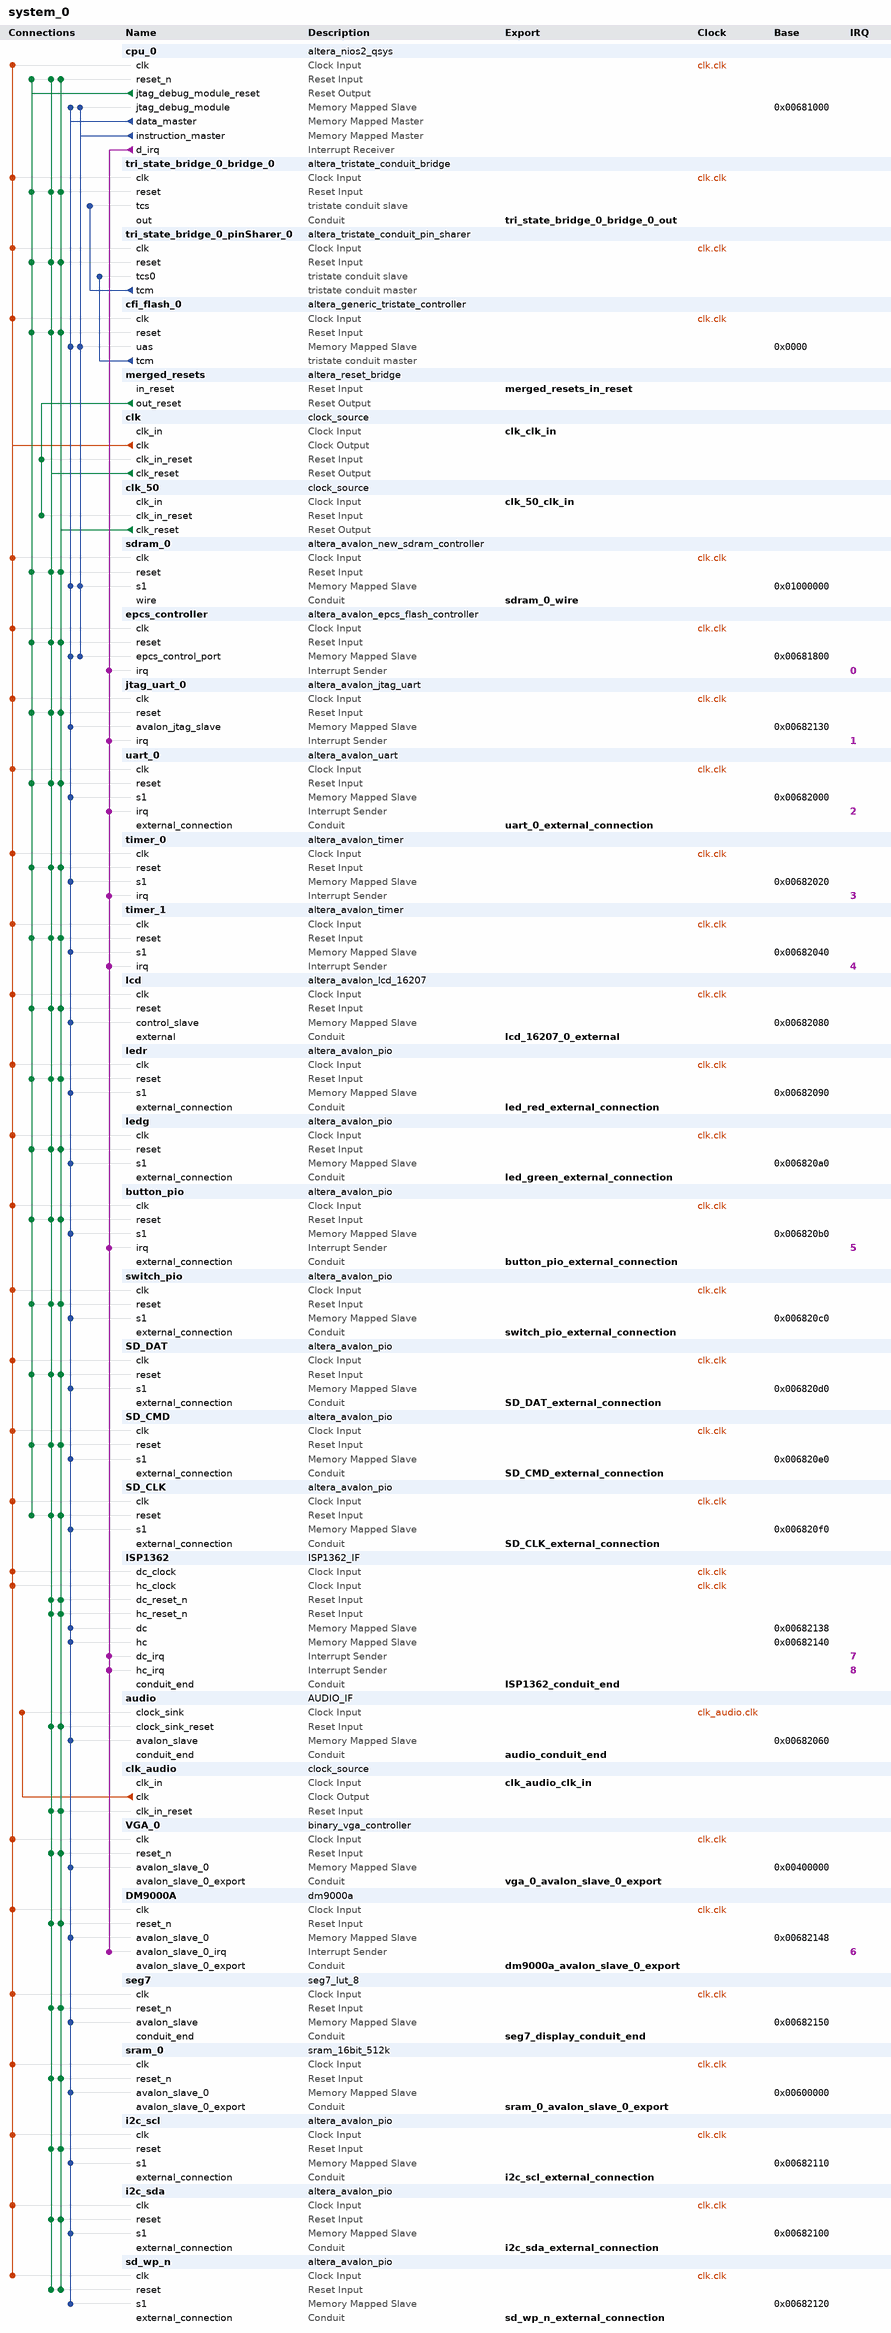
[diagram p0: system contents]
# Platform Designer (Qsys) system system_0, CYCLONEII EP2C35F672C6
# Parameters at their usual value, and those the tool derives, are not listed.
package require -exact qsys 11.1
create_system system_0
set_project_property DEVICE_FAMILY CYCLONEII
set_project_property DEVICE EP2C35F672C6

add_instance cpu_0 altera_nios2_qsys 11.1
set_instance_parameter_value cpu_0 manuallyAssignCpuID false
set_instance_parameter_value cpu_0 resetSlave sdram_0.s1
set_instance_parameter_value cpu_0 exceptionSlave sdram_0.s1
set_instance_parameter_value cpu_0 breakSlave cpu_0.jtag_debug_module
set_instance_parameter_value cpu_0 mmu_processIDNumBits 10
set_instance_parameter_value cpu_0 impl Fast
set_instance_parameter_value cpu_0 icache_size 4096
set_instance_parameter_value cpu_0 dcache_lineSize 4

add_instance tri_state_bridge_0_bridge_0 altera_tristate_conduit_bridge 11.1

add_instance tri_state_bridge_0_pinSharer_0 altera_tristate_conduit_pin_sharer 11.1
set_instance_parameter_value tri_state_bridge_0_pinSharer_0 NUM_INTERFACES 1
set_instance_parameter_value tri_state_bridge_0_pinSharer_0 MODULE_ORIGIN_LIST cfi_flash_0.tcm,cfi_flash_0.tcm,cfi_flash_0.tcm,cfi_flash_0.tcm,cfi_flash_0.tcm
set_instance_parameter_value tri_state_bridge_0_pinSharer_0 SHARED_SIGNAL_LIST tri_state_bridge_0_address,tri_state_bridge_0_readn,write_n_to_the_cfi_flash_0,tri_state_bridge_0_data,select_n_to_the_cfi_flash_0

add_instance cfi_flash_0 altera_generic_tristate_controller 11.1
set_instance_parameter_value cfi_flash_0 TCM_ADDRESS_W 22
set_instance_parameter_value cfi_flash_0 TCM_DATA_W 8
set_instance_parameter_value cfi_flash_0 TCM_BYTEENABLE_W 1
set_instance_parameter_value cfi_flash_0 TCM_READ_WAIT 160
set_instance_parameter_value cfi_flash_0 TCM_WRITE_WAIT 160
set_instance_parameter_value cfi_flash_0 TCM_SETUP_WAIT 40
set_instance_parameter_value cfi_flash_0 TCM_DATA_HOLD 40
set_instance_parameter_value cfi_flash_0 TCM_MAX_PENDING_READ_TRANSACTIONS 3
set_instance_parameter_value cfi_flash_0 TCM_TURNAROUND_TIME 2
set_instance_parameter_value cfi_flash_0 TCM_TIMING_UNITS 0
set_instance_parameter_value cfi_flash_0 TCM_READLATENCY 2
set_instance_parameter_value cfi_flash_0 TCM_SYMBOLS_PER_WORD 1
set_instance_parameter_value cfi_flash_0 USE_READ 1
set_instance_parameter_value cfi_flash_0 USE_BEGINTRANSFER 0
set_instance_parameter_value cfi_flash_0 USE_BYTEENABLE 0
set_instance_parameter_value cfi_flash_0 USE_OUTPUTENABLE 0
set_instance_parameter_value cfi_flash_0 ACTIVE_LOW_READ 1
set_instance_parameter_value cfi_flash_0 ACTIVE_LOW_BYTEENABLE 0
set_instance_parameter_value cfi_flash_0 ACTIVE_LOW_OUTPUTENABLE 0
set_instance_parameter_value cfi_flash_0 ACTIVE_LOW_BEGINTRANSFER 0
set_instance_parameter_value cfi_flash_0 CHIPSELECT_THROUGH_READLATENCY 0
set_instance_parameter_value cfi_flash_0 MODULE_ASSIGNMENT_KEYS embeddedsw.configuration.hwClassnameDriverSupportList,embeddedsw.configuration.hwClassnameDriverSupportDefault,embeddedsw.CMacro.SETUP_VALUE,embeddedsw.CMacro.WAIT_VALUE,embeddedsw.CMacro.HOLD_VALUE,embeddedsw.CMacro.TIMING_UNITS,embeddedsw.CMacro.SIZE,embeddedsw.memoryInfo.MEM_INIT_DATA_WIDTH,embeddedsw.memoryInfo.HAS_BYTE_LANE,embeddedsw.memoryInfo.IS_FLASH,embeddedsw.memoryInfo.GENERATE_DAT_SYM,embeddedsw.memoryInfo.GENERATE_FLASH,embeddedsw.memoryInfo.DAT_SYM_INSTALL_DIR,embeddedsw.memoryInfo.FLASH_INSTALL_DIR
set_instance_parameter_value cfi_flash_0 MODULE_ASSIGNMENT_VALUES {altera_avalon_lan91c111:altera_avalon_cfi_flash,altera_avalon_cfi_flash,40,160,40,"ns",4194304u,8,0,1,1,1,SIM_DIR,APP_DIR}
set_instance_parameter_value cfi_flash_0 INTERFACE_ASSIGNMENT_KEYS embeddedsw.configuration.isFlash,embeddedsw.configuration.isMemoryDevice,embeddedsw.configuration.isNonVolatileStorage
set_instance_parameter_value cfi_flash_0 INTERFACE_ASSIGNMENT_VALUES 1,1,1

add_instance merged_resets altera_reset_bridge 11.1
set_instance_parameter_value merged_resets ACTIVE_LOW_RESET 1
set_instance_parameter_value merged_resets SYNCHRONOUS_EDGES none

add_instance clk clock_source 11.1
set_instance_parameter_value clk clockFrequency 100000000

add_instance clk_50 clock_source 11.1
set_instance_parameter_value clk_50 clockFrequency 50000000

add_instance sdram_0 altera_avalon_new_sdram_controller 11.1
set_instance_parameter_value sdram_0 TAC 5.5
set_instance_parameter_value sdram_0 TRCD 20.0
set_instance_parameter_value sdram_0 TRP 20.0
set_instance_parameter_value sdram_0 casLatency 3
set_instance_parameter_value sdram_0 columnWidth 8
set_instance_parameter_value sdram_0 dataWidth 16
set_instance_parameter_value sdram_0 generateSimulationModel true
set_instance_parameter_value sdram_0 model custom
set_instance_parameter_value sdram_0 numberOfBanks 4
set_instance_parameter_value sdram_0 numberOfChipSelects 1
set_instance_parameter_value sdram_0 powerUpDelay 100.0
set_instance_parameter_value sdram_0 refreshPeriod 15.625
set_instance_parameter_value sdram_0 rowWidth 12

add_instance epcs_controller altera_avalon_epcs_flash_controller 11.1
set_instance_parameter_value epcs_controller useASMIAtom true

add_instance jtag_uart_0 altera_avalon_jtag_uart 11.1
set_instance_parameter_value jtag_uart_0 simInteractiveOptions INTERACTIVE_ASCII_OUTPUT

add_instance uart_0 altera_avalon_uart 11.1
set_instance_parameter_value uart_0 baud 115200
set_instance_parameter_value uart_0 dataBits 8
set_instance_parameter_value uart_0 fixedBaud true
set_instance_parameter_value uart_0 parity NONE
set_instance_parameter_value uart_0 stopBits 1

add_instance timer_0 altera_avalon_timer 11.1
set_instance_parameter_value timer_0 period 1
set_instance_parameter_value timer_0 periodUnits MSEC
set_instance_parameter_value timer_0 timerPreset CUSTOM

add_instance timer_1 altera_avalon_timer 11.1
set_instance_parameter_value timer_1 period 1
set_instance_parameter_value timer_1 periodUnits MSEC
set_instance_parameter_value timer_1 timerPreset CUSTOM

add_instance lcd altera_avalon_lcd_16207 11.1

add_instance ledr altera_avalon_pio 11.1
set_instance_parameter_value ledr direction Output
set_instance_parameter_value ledr width 18

add_instance ledg altera_avalon_pio 11.1
set_instance_parameter_value ledg direction Output
set_instance_parameter_value ledg width 9

add_instance button_pio altera_avalon_pio 11.1
set_instance_parameter_value button_pio captureEdge true
set_instance_parameter_value button_pio direction Input
set_instance_parameter_value button_pio edgeType FALLING
set_instance_parameter_value button_pio generateIRQ true
set_instance_parameter_value button_pio irqType EDGE
set_instance_parameter_value button_pio width 4

add_instance switch_pio altera_avalon_pio 11.1
set_instance_parameter_value switch_pio direction Input
set_instance_parameter_value switch_pio width 18

add_instance SD_DAT altera_avalon_pio 11.1
set_instance_parameter_value SD_DAT direction Bidir
set_instance_parameter_value SD_DAT width 4

add_instance SD_CMD altera_avalon_pio 11.1
set_instance_parameter_value SD_CMD direction Bidir
set_instance_parameter_value SD_CMD width 1

add_instance SD_CLK altera_avalon_pio 11.1
set_instance_parameter_value SD_CLK direction Output
set_instance_parameter_value SD_CLK width 1

add_instance ISP1362 ISP1362_IF 1.0

add_instance audio AUDIO_IF 2.0

add_instance clk_audio clock_source 11.1
set_instance_parameter_value clk_audio clockFrequency 18400000

add_instance VGA_0 binary_vga_controller 1.0.2
set_instance_parameter_value VGA_0 RAM_SIZE 307200

add_instance DM9000A dm9000a 1.0.2

add_instance seg7 seg7_lut_8 1.0.1

add_instance sram_0 sram_16bit_512k 1.0.2

add_instance i2c_scl altera_avalon_pio 11.1
set_instance_parameter_value i2c_scl direction Output
set_instance_parameter_value i2c_scl width 1

add_instance i2c_sda altera_avalon_pio 11.1
set_instance_parameter_value i2c_sda direction Bidir
set_instance_parameter_value i2c_sda width 1

add_instance sd_wp_n altera_avalon_pio 11.1
set_instance_parameter_value sd_wp_n direction Input
set_instance_parameter_value sd_wp_n width 1

# connections
add_connection clk.clk button_pio.clk clock
add_connection clk.clk cfi_flash_0.clk clock
add_connection clk.clk cpu_0.clk clock
add_connection clk.clk DM9000A.clk clock
add_connection clk.clk epcs_controller.clk clock
add_connection clk.clk i2c_scl.clk clock
add_connection clk.clk i2c_sda.clk clock
add_connection clk.clk ISP1362.dc_clock clock
add_connection clk.clk ISP1362.hc_clock clock
add_connection clk.clk jtag_uart_0.clk clock
add_connection clk.clk lcd.clk clock
add_connection clk.clk ledg.clk clock
add_connection clk.clk ledr.clk clock
add_connection clk.clk SD_CLK.clk clock
add_connection clk.clk SD_CMD.clk clock
add_connection clk.clk SD_DAT.clk clock
add_connection clk.clk sd_wp_n.clk clock
add_connection clk.clk sdram_0.clk clock
add_connection clk.clk seg7.clk clock
add_connection clk.clk sram_0.clk clock
add_connection clk.clk switch_pio.clk clock
add_connection clk.clk timer_0.clk clock
add_connection clk.clk timer_1.clk clock
add_connection clk.clk tri_state_bridge_0_bridge_0.clk clock
add_connection clk.clk tri_state_bridge_0_pinSharer_0.clk clock
add_connection clk.clk uart_0.clk clock
add_connection clk.clk VGA_0.clk clock
add_connection clk_audio.clk audio.clock_sink clock
add_connection clk.clk_reset audio.clock_sink_reset reset
add_connection clk.clk_reset button_pio.reset reset
add_connection clk.clk_reset cfi_flash_0.reset reset
add_connection clk.clk_reset clk_audio.clk_in_reset reset
add_connection clk.clk_reset cpu_0.reset_n reset
add_connection clk.clk_reset DM9000A.reset_n reset
add_connection clk.clk_reset epcs_controller.reset reset
add_connection clk.clk_reset i2c_scl.reset reset
add_connection clk.clk_reset i2c_sda.reset reset
add_connection clk.clk_reset ISP1362.dc_reset_n reset
add_connection clk.clk_reset ISP1362.hc_reset_n reset
add_connection clk.clk_reset jtag_uart_0.reset reset
add_connection clk.clk_reset lcd.reset reset
add_connection clk.clk_reset ledg.reset reset
add_connection clk.clk_reset ledr.reset reset
add_connection clk.clk_reset SD_CLK.reset reset
add_connection clk.clk_reset SD_CMD.reset reset
add_connection clk.clk_reset SD_DAT.reset reset
add_connection clk.clk_reset sd_wp_n.reset reset
add_connection clk.clk_reset sdram_0.reset reset
add_connection clk.clk_reset seg7.reset_n reset
add_connection clk.clk_reset sram_0.reset_n reset
add_connection clk.clk_reset switch_pio.reset reset
add_connection clk.clk_reset timer_0.reset reset
add_connection clk.clk_reset timer_1.reset reset
add_connection clk.clk_reset tri_state_bridge_0_bridge_0.reset reset
add_connection clk.clk_reset tri_state_bridge_0_pinSharer_0.reset reset
add_connection clk.clk_reset uart_0.reset reset
add_connection clk.clk_reset VGA_0.reset_n reset
add_connection clk_50.clk_reset audio.clock_sink_reset reset
add_connection clk_50.clk_reset button_pio.reset reset
add_connection clk_50.clk_reset cfi_flash_0.reset reset
add_connection clk_50.clk_reset clk_audio.clk_in_reset reset
add_connection clk_50.clk_reset cpu_0.reset_n reset
add_connection clk_50.clk_reset DM9000A.reset_n reset
add_connection clk_50.clk_reset epcs_controller.reset reset
add_connection clk_50.clk_reset i2c_scl.reset reset
add_connection clk_50.clk_reset i2c_sda.reset reset
add_connection clk_50.clk_reset ISP1362.dc_reset_n reset
add_connection clk_50.clk_reset ISP1362.hc_reset_n reset
add_connection clk_50.clk_reset jtag_uart_0.reset reset
add_connection clk_50.clk_reset lcd.reset reset
add_connection clk_50.clk_reset ledg.reset reset
add_connection clk_50.clk_reset ledr.reset reset
add_connection clk_50.clk_reset SD_CLK.reset reset
add_connection clk_50.clk_reset SD_CMD.reset reset
add_connection clk_50.clk_reset SD_DAT.reset reset
add_connection clk_50.clk_reset sd_wp_n.reset reset
add_connection clk_50.clk_reset sdram_0.reset reset
add_connection clk_50.clk_reset seg7.reset_n reset
add_connection clk_50.clk_reset sram_0.reset_n reset
add_connection clk_50.clk_reset switch_pio.reset reset
add_connection clk_50.clk_reset timer_0.reset reset
add_connection clk_50.clk_reset timer_1.reset reset
add_connection clk_50.clk_reset tri_state_bridge_0_bridge_0.reset reset
add_connection clk_50.clk_reset tri_state_bridge_0_pinSharer_0.reset reset
add_connection clk_50.clk_reset uart_0.reset reset
add_connection clk_50.clk_reset VGA_0.reset_n reset
add_connection cpu_0.jtag_debug_module_reset button_pio.reset reset
add_connection cpu_0.jtag_debug_module_reset cfi_flash_0.reset reset
add_connection cpu_0.jtag_debug_module_reset cpu_0.reset_n reset
add_connection cpu_0.jtag_debug_module_reset epcs_controller.reset reset
add_connection cpu_0.jtag_debug_module_reset jtag_uart_0.reset reset
add_connection cpu_0.jtag_debug_module_reset lcd.reset reset
add_connection cpu_0.jtag_debug_module_reset ledg.reset reset
add_connection cpu_0.jtag_debug_module_reset ledr.reset reset
add_connection cpu_0.jtag_debug_module_reset SD_CLK.reset reset
add_connection cpu_0.jtag_debug_module_reset SD_CMD.reset reset
add_connection cpu_0.jtag_debug_module_reset SD_DAT.reset reset
add_connection cpu_0.jtag_debug_module_reset sdram_0.reset reset
add_connection cpu_0.jtag_debug_module_reset switch_pio.reset reset
add_connection cpu_0.jtag_debug_module_reset timer_0.reset reset
add_connection cpu_0.jtag_debug_module_reset timer_1.reset reset
add_connection cpu_0.jtag_debug_module_reset tri_state_bridge_0_bridge_0.reset reset
add_connection cpu_0.jtag_debug_module_reset tri_state_bridge_0_pinSharer_0.reset reset
add_connection cpu_0.jtag_debug_module_reset uart_0.reset reset
add_connection merged_resets.out_reset clk.clk_in_reset reset
add_connection merged_resets.out_reset clk_50.clk_in_reset reset
add_connection cpu_0.data_master audio.avalon_slave avalon
set_connection_parameter_value cpu_0.data_master/audio.avalon_slave baseAddress 0x00682060
add_connection cpu_0.data_master button_pio.s1 avalon
set_connection_parameter_value cpu_0.data_master/button_pio.s1 baseAddress 0x006820b0
add_connection cpu_0.data_master cfi_flash_0.uas avalon
set_connection_parameter_value cpu_0.data_master/cfi_flash_0.uas baseAddress 0x0000
add_connection cpu_0.data_master cpu_0.jtag_debug_module avalon
set_connection_parameter_value cpu_0.data_master/cpu_0.jtag_debug_module baseAddress 0x00681000
add_connection cpu_0.data_master DM9000A.avalon_slave_0 avalon
set_connection_parameter_value cpu_0.data_master/DM9000A.avalon_slave_0 baseAddress 0x00682148
add_connection cpu_0.data_master epcs_controller.epcs_control_port avalon
set_connection_parameter_value cpu_0.data_master/epcs_controller.epcs_control_port baseAddress 0x00681800
add_connection cpu_0.data_master i2c_scl.s1 avalon
set_connection_parameter_value cpu_0.data_master/i2c_scl.s1 baseAddress 0x00682110
add_connection cpu_0.data_master i2c_sda.s1 avalon
set_connection_parameter_value cpu_0.data_master/i2c_sda.s1 baseAddress 0x00682100
add_connection cpu_0.data_master ISP1362.dc avalon
set_connection_parameter_value cpu_0.data_master/ISP1362.dc baseAddress 0x00682138
add_connection cpu_0.data_master ISP1362.hc avalon
set_connection_parameter_value cpu_0.data_master/ISP1362.hc baseAddress 0x00682140
add_connection cpu_0.data_master jtag_uart_0.avalon_jtag_slave avalon
set_connection_parameter_value cpu_0.data_master/jtag_uart_0.avalon_jtag_slave baseAddress 0x00682130
add_connection cpu_0.data_master lcd.control_slave avalon
set_connection_parameter_value cpu_0.data_master/lcd.control_slave baseAddress 0x00682080
add_connection cpu_0.data_master ledg.s1 avalon
set_connection_parameter_value cpu_0.data_master/ledg.s1 baseAddress 0x006820a0
add_connection cpu_0.data_master ledr.s1 avalon
set_connection_parameter_value cpu_0.data_master/ledr.s1 baseAddress 0x00682090
add_connection cpu_0.data_master SD_CLK.s1 avalon
set_connection_parameter_value cpu_0.data_master/SD_CLK.s1 baseAddress 0x006820f0
add_connection cpu_0.data_master SD_CMD.s1 avalon
set_connection_parameter_value cpu_0.data_master/SD_CMD.s1 baseAddress 0x006820e0
add_connection cpu_0.data_master SD_DAT.s1 avalon
set_connection_parameter_value cpu_0.data_master/SD_DAT.s1 baseAddress 0x006820d0
add_connection cpu_0.data_master sd_wp_n.s1 avalon
set_connection_parameter_value cpu_0.data_master/sd_wp_n.s1 baseAddress 0x00682120
add_connection cpu_0.data_master sdram_0.s1 avalon
set_connection_parameter_value cpu_0.data_master/sdram_0.s1 baseAddress 0x01000000
add_connection cpu_0.data_master seg7.avalon_slave avalon
set_connection_parameter_value cpu_0.data_master/seg7.avalon_slave baseAddress 0x00682150
add_connection cpu_0.data_master sram_0.avalon_slave_0 avalon
set_connection_parameter_value cpu_0.data_master/sram_0.avalon_slave_0 baseAddress 0x00600000
add_connection cpu_0.data_master switch_pio.s1 avalon
set_connection_parameter_value cpu_0.data_master/switch_pio.s1 baseAddress 0x006820c0
add_connection cpu_0.data_master timer_0.s1 avalon
set_connection_parameter_value cpu_0.data_master/timer_0.s1 baseAddress 0x00682020
add_connection cpu_0.data_master timer_1.s1 avalon
set_connection_parameter_value cpu_0.data_master/timer_1.s1 baseAddress 0x00682040
add_connection cpu_0.data_master uart_0.s1 avalon
set_connection_parameter_value cpu_0.data_master/uart_0.s1 baseAddress 0x00682000
add_connection cpu_0.data_master VGA_0.avalon_slave_0 avalon
set_connection_parameter_value cpu_0.data_master/VGA_0.avalon_slave_0 baseAddress 0x00400000
add_connection cpu_0.instruction_master cfi_flash_0.uas avalon
set_connection_parameter_value cpu_0.instruction_master/cfi_flash_0.uas baseAddress 0x0000
add_connection cpu_0.instruction_master cpu_0.jtag_debug_module avalon
set_connection_parameter_value cpu_0.instruction_master/cpu_0.jtag_debug_module baseAddress 0x00681000
add_connection cpu_0.instruction_master epcs_controller.epcs_control_port avalon
set_connection_parameter_value cpu_0.instruction_master/epcs_controller.epcs_control_port baseAddress 0x00681800
add_connection cpu_0.instruction_master sdram_0.s1 avalon
set_connection_parameter_value cpu_0.instruction_master/sdram_0.s1 baseAddress 0x01000000
add_connection cpu_0.d_irq button_pio.irq interrupt
set_connection_parameter_value cpu_0.d_irq/button_pio.irq irqNumber 5
add_connection cpu_0.d_irq DM9000A.avalon_slave_0_irq interrupt
set_connection_parameter_value cpu_0.d_irq/DM9000A.avalon_slave_0_irq irqNumber 6
add_connection cpu_0.d_irq epcs_controller.irq interrupt
set_connection_parameter_value cpu_0.d_irq/epcs_controller.irq irqNumber 0
add_connection cpu_0.d_irq ISP1362.dc_irq interrupt
set_connection_parameter_value cpu_0.d_irq/ISP1362.dc_irq irqNumber 7
add_connection cpu_0.d_irq ISP1362.hc_irq interrupt
set_connection_parameter_value cpu_0.d_irq/ISP1362.hc_irq irqNumber 8
add_connection cpu_0.d_irq jtag_uart_0.irq interrupt
set_connection_parameter_value cpu_0.d_irq/jtag_uart_0.irq irqNumber 1
add_connection cpu_0.d_irq timer_0.irq interrupt
set_connection_parameter_value cpu_0.d_irq/timer_0.irq irqNumber 3
add_connection cpu_0.d_irq timer_1.irq interrupt
set_connection_parameter_value cpu_0.d_irq/timer_1.irq irqNumber 4
add_connection cpu_0.d_irq uart_0.irq interrupt
set_connection_parameter_value cpu_0.d_irq/uart_0.irq irqNumber 2
add_connection cfi_flash_0.tcm tri_state_bridge_0_pinSharer_0.tcs0 tristate_conduit
add_connection tri_state_bridge_0_pinSharer_0.tcm tri_state_bridge_0_bridge_0.tcs tristate_conduit

# exported interfaces
add_interface clk_50_clk_in clock sink
set_interface_property clk_50_clk_in EXPORT_OF clk_50.clk_in
add_interface SD_DAT_external_connection conduit end
set_interface_property SD_DAT_external_connection EXPORT_OF SD_DAT.external_connection
add_interface led_red_external_connection conduit end
set_interface_property led_red_external_connection EXPORT_OF ledr.external_connection
add_interface sdram_0_wire conduit end
set_interface_property sdram_0_wire EXPORT_OF sdram_0.wire
add_interface tri_state_bridge_0_bridge_0_out conduit end
set_interface_property tri_state_bridge_0_bridge_0_out EXPORT_OF tri_state_bridge_0_bridge_0.out
add_interface merged_resets_in_reset reset sink
set_interface_property merged_resets_in_reset EXPORT_OF merged_resets.in_reset
add_interface SD_CMD_external_connection conduit end
set_interface_property SD_CMD_external_connection EXPORT_OF SD_CMD.external_connection
add_interface ISP1362_conduit_end conduit end
set_interface_property ISP1362_conduit_end EXPORT_OF ISP1362.conduit_end
add_interface SD_CLK_external_connection conduit end
set_interface_property SD_CLK_external_connection EXPORT_OF SD_CLK.external_connection
add_interface button_pio_external_connection conduit end
set_interface_property button_pio_external_connection EXPORT_OF button_pio.external_connection
add_interface led_green_external_connection conduit end
set_interface_property led_green_external_connection EXPORT_OF ledg.external_connection
add_interface clk_clk_in clock sink
set_interface_property clk_clk_in EXPORT_OF clk.clk_in
add_interface switch_pio_external_connection conduit end
set_interface_property switch_pio_external_connection EXPORT_OF switch_pio.external_connection
add_interface lcd_16207_0_external conduit end
set_interface_property lcd_16207_0_external EXPORT_OF lcd.external
add_interface uart_0_external_connection conduit end
set_interface_property uart_0_external_connection EXPORT_OF uart_0.external_connection
add_interface vga_0_avalon_slave_0_export conduit end
set_interface_property vga_0_avalon_slave_0_export EXPORT_OF VGA_0.avalon_slave_0_export
add_interface dm9000a_avalon_slave_0_export conduit end
set_interface_property dm9000a_avalon_slave_0_export EXPORT_OF DM9000A.avalon_slave_0_export
add_interface seg7_display_conduit_end conduit end
set_interface_property seg7_display_conduit_end EXPORT_OF seg7.conduit_end
add_interface sram_0_avalon_slave_0_export conduit end
set_interface_property sram_0_avalon_slave_0_export EXPORT_OF sram_0.avalon_slave_0_export
add_interface i2c_sda_external_connection conduit end
set_interface_property i2c_sda_external_connection EXPORT_OF i2c_sda.external_connection
add_interface i2c_scl_external_connection conduit end
set_interface_property i2c_scl_external_connection EXPORT_OF i2c_scl.external_connection
add_interface sd_wp_n_external_connection conduit end
set_interface_property sd_wp_n_external_connection EXPORT_OF sd_wp_n.external_connection
add_interface audio_conduit_end conduit end
set_interface_property audio_conduit_end EXPORT_OF audio.conduit_end
add_interface clk_audio_clk_in clock sink
set_interface_property clk_audio_clk_in EXPORT_OF clk_audio.clk_in

save_system system_0.qsys
